# Altium schematic sheet MGNGSQ4_Loopback.SchDoc
size A
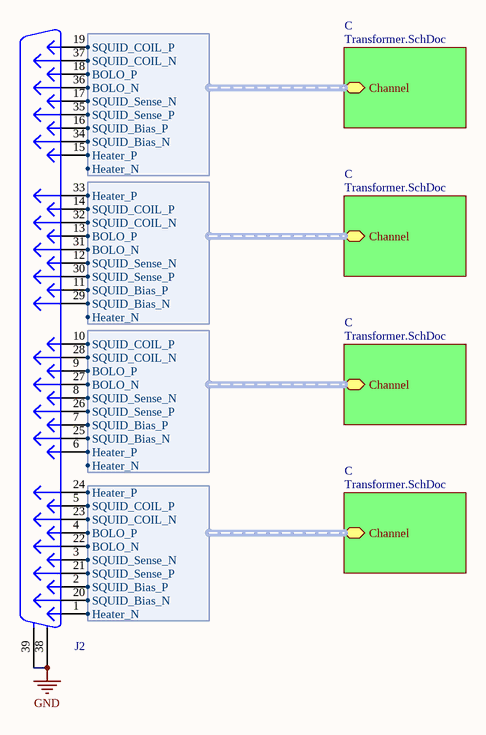
[diagram p0: MGNGSQ4_Loopback.SchDoc]

## Parts
J2  DB37M  [DSUB37-M]  (value not drawn)

## Sub-sheets
C = Transformer.SchDoc: Channel (harness SQUID_CH_IN)
C = Transformer.SchDoc: Channel (harness SQUID_CH_IN)
C = Transformer.SchDoc: Channel (harness SQUID_CH_IN)
C = Transformer.SchDoc: Channel (harness SQUID_CH_IN)

## Harnesses
SQUID_CH_IN: SQUID_COIL_P, SQUID_COIL_N, BOLO_P, BOLO_N, SQUID_Sense_P, SQUID_Bias_P, SQUID_Bias_N, Heater_P, SQUID_Sense_N, Heater_N

## Nets
GND: J2.38(MH1) J2.39(MH2)
NetJ2_1: J2.1 ; sheet C/Channel.Heater_N
NetJ2_2: J2.2 ; sheet C/Channel.SQUID_Bias_P
NetJ2_3: J2.3 ; sheet C/Channel.SQUID_Sense_N
NetJ2_4: J2.4 ; sheet C/Channel.BOLO_P
NetJ2_5: J2.5 ; sheet C/Channel.SQUID_COIL_P
NetJ2_6: J2.6 ; sheet C/Channel.Heater_P
NetJ2_7: J2.7 ; sheet C/Channel.SQUID_Bias_P
NetJ2_8: J2.8 ; sheet C/Channel.SQUID_Sense_N
NetJ2_9: J2.9 ; sheet C/Channel.BOLO_P
NetJ2_10: J2.10 ; sheet C/Channel.SQUID_COIL_P
NetJ2_11: J2.11 ; sheet C/Channel.SQUID_Bias_P
NetJ2_12: J2.12 ; sheet C/Channel.SQUID_Sense_N
NetJ2_13: J2.13 ; sheet C/Channel.BOLO_P
NetJ2_14: J2.14 ; sheet C/Channel.SQUID_COIL_P
NetJ2_15: J2.15 ; sheet C/Channel.Heater_P
NetJ2_16: J2.16 ; sheet C/Channel.SQUID_Bias_P
NetJ2_17: J2.17 ; sheet C/Channel.SQUID_Sense_N
NetJ2_18: J2.18 ; sheet C/Channel.BOLO_P
NetJ2_19: J2.19 ; sheet C/Channel.SQUID_COIL_P
NetJ2_20: J2.20 ; sheet C/Channel.SQUID_Bias_N
NetJ2_21: J2.21 ; sheet C/Channel.SQUID_Sense_P
NetJ2_22: J2.22 ; sheet C/Channel.BOLO_N
NetJ2_23: J2.23 ; sheet C/Channel.SQUID_COIL_N
NetJ2_24: J2.24 ; sheet C/Channel.Heater_P
NetJ2_25: J2.25 ; sheet C/Channel.SQUID_Bias_N
NetJ2_26: J2.26 ; sheet C/Channel.SQUID_Sense_P
NetJ2_27: J2.27 ; sheet C/Channel.BOLO_N
NetJ2_28: J2.28 ; sheet C/Channel.SQUID_COIL_N
NetJ2_29: J2.29 ; sheet C/Channel.SQUID_Bias_N
NetJ2_30: J2.30 ; sheet C/Channel.SQUID_Sense_P
NetJ2_31: J2.31 ; sheet C/Channel.BOLO_N
NetJ2_32: J2.32 ; sheet C/Channel.SQUID_COIL_N
NetJ2_33: J2.33 ; sheet C/Channel.Heater_P
NetJ2_34: J2.34 ; sheet C/Channel.SQUID_Bias_N
NetJ2_35: J2.35 ; sheet C/Channel.SQUID_Sense_P
NetJ2_36: J2.36 ; sheet C/Channel.BOLO_N
NetJ2_37: J2.37 ; sheet C/Channel.SQUID_COIL_N

## Library data of the parts
J2 = DB37M: Assembly Comments: none; Manufacturers Part Number: DB37M; Type: Connector; SupplierUnitCost: $3.35